# EAGLE design init (EAGLE 9.6.2)
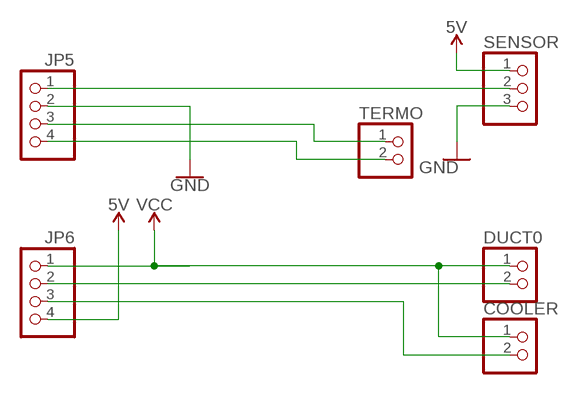
[diagram p0: schematic, sheet 1]

## Parts
COOLER  PINHD-1X2  [1X02]
DUCT0  PINHD-1X2  [1X02]
JP5  PINHD-1X4  [1X04]
JP6  PINHD-1X4  [1X04]
SENSOR  PINHD-1X3  [1X03]
TERMO  PINHD-1X2  [1X02]

## Nets
5V: JP6.4 SENSOR.1
GND: JP5.2 SENSOR.3
N$1: JP5.1 SENSOR.2
N$2: COOLER.2 JP6.3
N$3: JP5.3 TERMO.1
N$5: JP5.4 TERMO.2
N$9: DUCT0.2 JP6.2
VCC: COOLER.1 DUCT0.1 JP6.1

## Library data of the parts
COOLER DUCT0 TERMO = pinhead:PINHD-1X2: PIN HEADER
JP5 JP6 = pinhead:PINHD-1X4: PIN HEADER
SENSOR = pinhead:PINHD-1X3: PIN HEADER

## Board
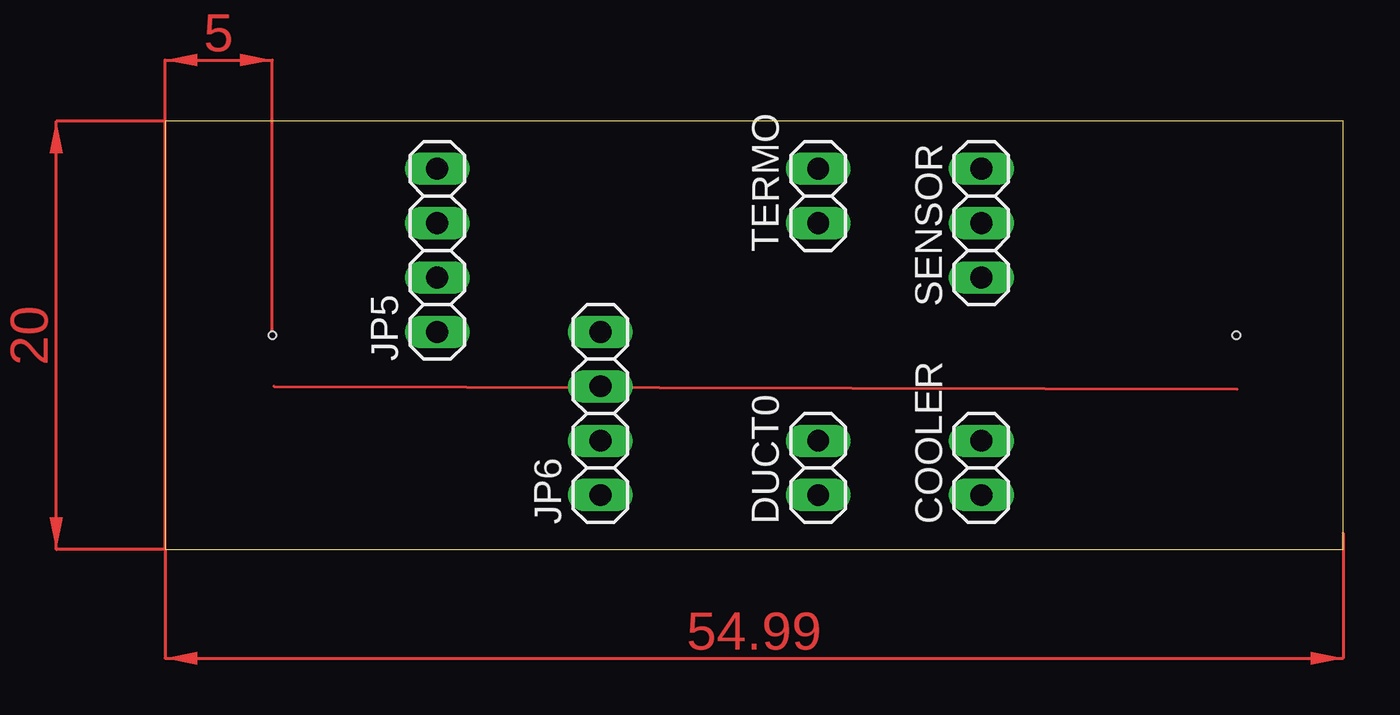
[diagram p1: board, top side]
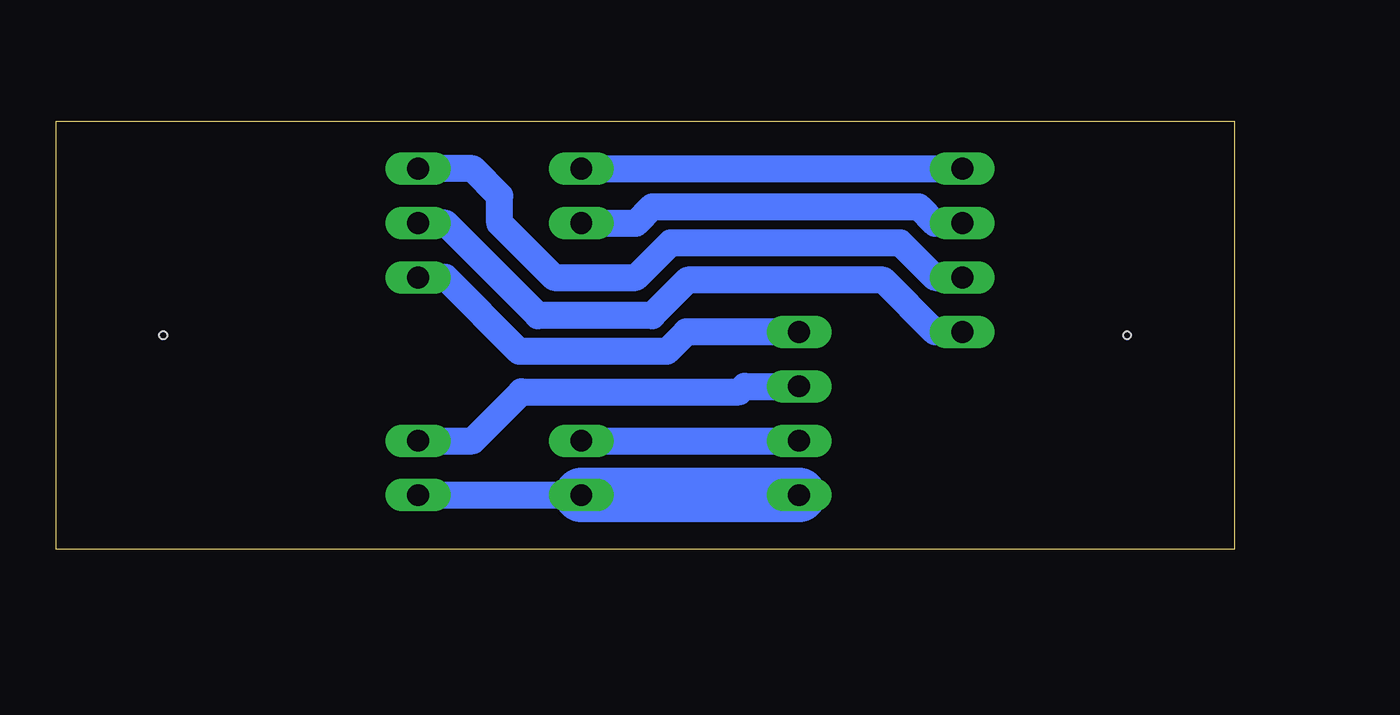
[diagram p2: board, bottom side, seen from below]

Size 55 x 20 mm. Coordinates in mm from the lower left corner, seen from the top.
Outline: 0,0 55,0 55,20 0,20 0,0
Copper layers (1*16): Top 0.035mm / dielectric 1.5mm / Bottom 0.035mm
Design rules "corexy_DRC": minimum track width 0.6mm, minimum drill 0.35mm, track to track 0.4mm, track to pad 0.4mm, pad to pad 0.4mm, via to via 0.4mm, smd to smd 0.4mm, copper to edge 0.4mm, drill to drill 0.4mm, minimum pad ring 10mil, minimum via ring 8mil, stop-mask expansion 4mil, vias tented up to drill 0mil, thermal gap 10mil
Holes 0.35 mm at 5,10 50,10

### Footprints (pad centres in the part's own frame; a part is rotated, then mirrored left to right if it is on the bottom)
1X02 = drill 1.016 long: 1 -1.27,0; 2 1.27,0
1X04 = drill 1.016 long: 1 -3.81,0; 2 -1.27,0; 3 1.27,0; 4 3.81,0
1X03 = drill 1.016 long: 1 -2.54,0; 2 0,0; 3 2.54,0

### Placement (x,y rotation side)
COOLER  38.1,3.81 90 top
DUCT0  30.48,3.81 90 top
JP5  12.7,13.97 90 top
JP6  20.32,6.35 90 top
SENSOR  38.1,15.24 90 top
TERMO  30.48,16.51 90 top

### Tracks (layer width: path | path; a pad name or v marks a point on that pad's centre or on a via)
5V
  Bottom 1.27: JP6.4 25.58,10.16 26.49,9.25 33.38,9.25 36.83,12.7 SENSOR.1
GND
  Bottom 1.27: JP5.2 13.97,12.7 15.6,14.33 26.31,14.33 27.94,12.7 31.75,12.7 34.29,15.24 34.29,16.51 35.56,17.78 SENSOR.3
N$1
  Bottom 1.27: JP5.1 13.97,10.16 16.38,12.57 25.53,12.57 27.18,10.92 32.51,10.92 36.83,15.24 SENSOR.2
N$2
  Bottom 1.27: JP6.3 22.86,7.62 23.11,7.37 33.27,7.37 35.56,5.08 COOLER.2
N$3
  Bottom 1.27: TERMO.1 27.94,15.24 27.18,16 14.73,16 13.97,15.24 JP5.3
N$5
  Bottom 1.27: TERMO.2 JP5.4
N$9
  Bottom 1.27: DUCT0.2 JP6.2
VCC
  Bottom 1.27: COOLER.1 DUCT0.1
  Bottom 2.54: JP6.1 DUCT0.1
(copper drawn outside any net)
  shapes: Top area x4